# Altium schematic sheet hv_Isolation.SchDoc
size A; SheetNumber: 9; SheetTotal: 12
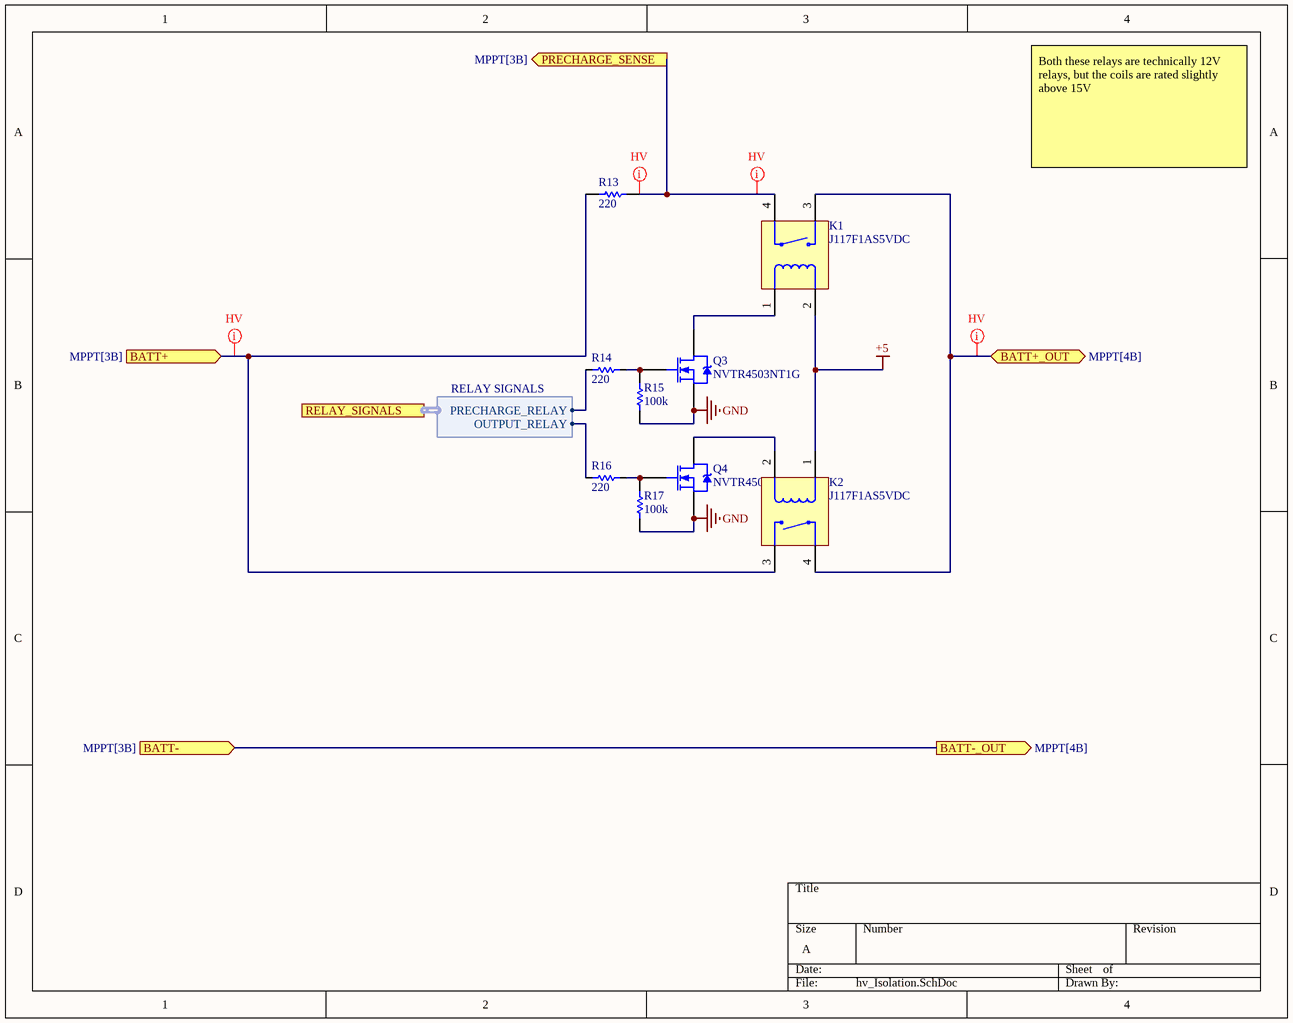
[diagram p0: hv_Isolation.SchDoc]

## Parts
K1  J117F1AS5VDC  [J117F1AS5VDC-Footprint]
K2  J117F1AS5VDC  [J117F1AS5VDC-Footprint]
Q3  NVTR4503NT1G  [SOT-23_N]
Q4  NVTR4503NT1G  [SOT-23_N]
R13  value 220  [R_Res_Axial_SQP_THRU]  (hidden comment: SQPW10220RJ)
R14  value 220  [0603_RESISTOR]  (hidden comment: R 0603 220 ohm 1%)
R15  value 100k  [RESC1608X55X25ML10T15]  (hidden comment: Resistor 100k +/-1% 0603 100 mW)
R16  value 220  [0603_RESISTOR]  (hidden comment: R 0603 220 ohm 1%)
R17  value 100k  [RESC1608X55X25ML10T15]  (hidden comment: Resistor 100k +/-1% 0603 100 mW)

## Ports
BATT+ (in, see MPPT[3B]), BATT+_OUT (bidir, see MPPT[4B]), BATT- (in, see MPPT[3B]), BATT-_OUT (out, see MPPT[4B]), PRECHARGE_SENSE (out, see MPPT[3B]), RELAY_SIGNALS (harness RELAY SIGNALS, see MPPT[3B], MicroController[2B])

## Harnesses
RELAY SIGNALS: OUTPUT_RELAY, PRECHARGE_RELAY

## Nets
+5: K1.2(CTRL-) K2.1(CTRL+)
GND: Q3.2(S) Q4.2(S) R15.1 R17.1
BATT+: K2.3(DC-) R13.1 ; port BATT+
BATT+_OUT: K1.3(DC-) K2.4(DC+) ; port BATT+_OUT
BATT-: port BATT-_OUT, port BATT-
PRECHARGE_SENSE: K1.4(DC+) R13.2 ; port PRECHARGE_SENSE
NetK1_1: K1.1(CTRL+) Q3.3(D)
NetK2_2: K2.2(CTRL-) Q4.3(D)
NetQ3_1: Q3.1(G) R14.2 R15.2
NetQ4_1: Q4.1(G) R16.2 R17.2
NetR14_1: R14.1 ; port RELAY_SIGNALS.PRECHARGE_RELAY
NetR16_1: R16.1 ; port RELAY_SIGNALS.OUTPUT_RELAY

## Layout directives
net class HV: BATT+, BATT+_OUT, PRECHARGE_SENSE

## Notes on the sheet
- Both these relays are technically 12V relays, but the coils are rated slightly above 15V

## Library data of the parts
K1 K2 = CMP-008-00017-3: Relay Gen Purpose SPST 10A 5V; Operate Time: 10ms; Coil Voltage: 5; RoHS Compliant: yes; Pins: 4; Contact Form: SPST; Mounting Technology: TH; Max Operating Temperature: 125°C; Current Rating: 10A; Min Operating Temperature: -55°C
Q3 Q4 = CMP-062-000014-2: Small Signal Field-Effect Transistor, 1.5A I(D), 30V, 1-Element, N-Channel, Silicon, Metal-oxide Semiconductor FET, TO-236; Max Operating Temperature: 150°C; Case/Package: SOT23; PackageReference: SOT-23; Vgs(th) (Max) @ Id: 1.5A; RoHS Compliant: Yes; Pins: 3
R13 = Resistor     0016-2: Fixed Resistor, Wire Wound, 10W, 220ohm, 750V, 5% +/-Tol, 300ppm/Cel, Through Hole Mount; Tolerance: 5%; Case/Package: Axial; Pins: 2; RoHS Compliant: Yes; Mounting Technology: TH; Min Operating Temperature: -55°C; Power: 10W; Max Operating Temperature: 155°C
R14 R16 = CMP-058-000021-5: RES 220 OHM 1/16W 1% 0603 SMD; Power: 62.5mW; Case/Package: 0603; Tolerance: 1%; Mounting Technology: SMD; Pins: 2
R15 R17 = CMP-009-00023-8: Chip Resistor, 100 KOhm, +/- 1%, 0.1 W, -55 to 155 degC, 0603 (1608 Metric); Power: 100mW; Voltage Rating: 50V; Case/Package: 0603; RoHS Compliant: True; Mounting Technology: SMD; Min Operating Temperature: -55°C; Tolerance: 1%; Pins: 2; Max Operating Temperature: 155°C